# EasyEDA schematic A1_PROM_schematic_64_128.json
TITLE: APPLE-1 MULTI-PROM REPLACEMENT; REV: 1.2; Date: 2020-05-17; Sheet: 1/1; Drawn By: P- Lab; Company: P-LAB
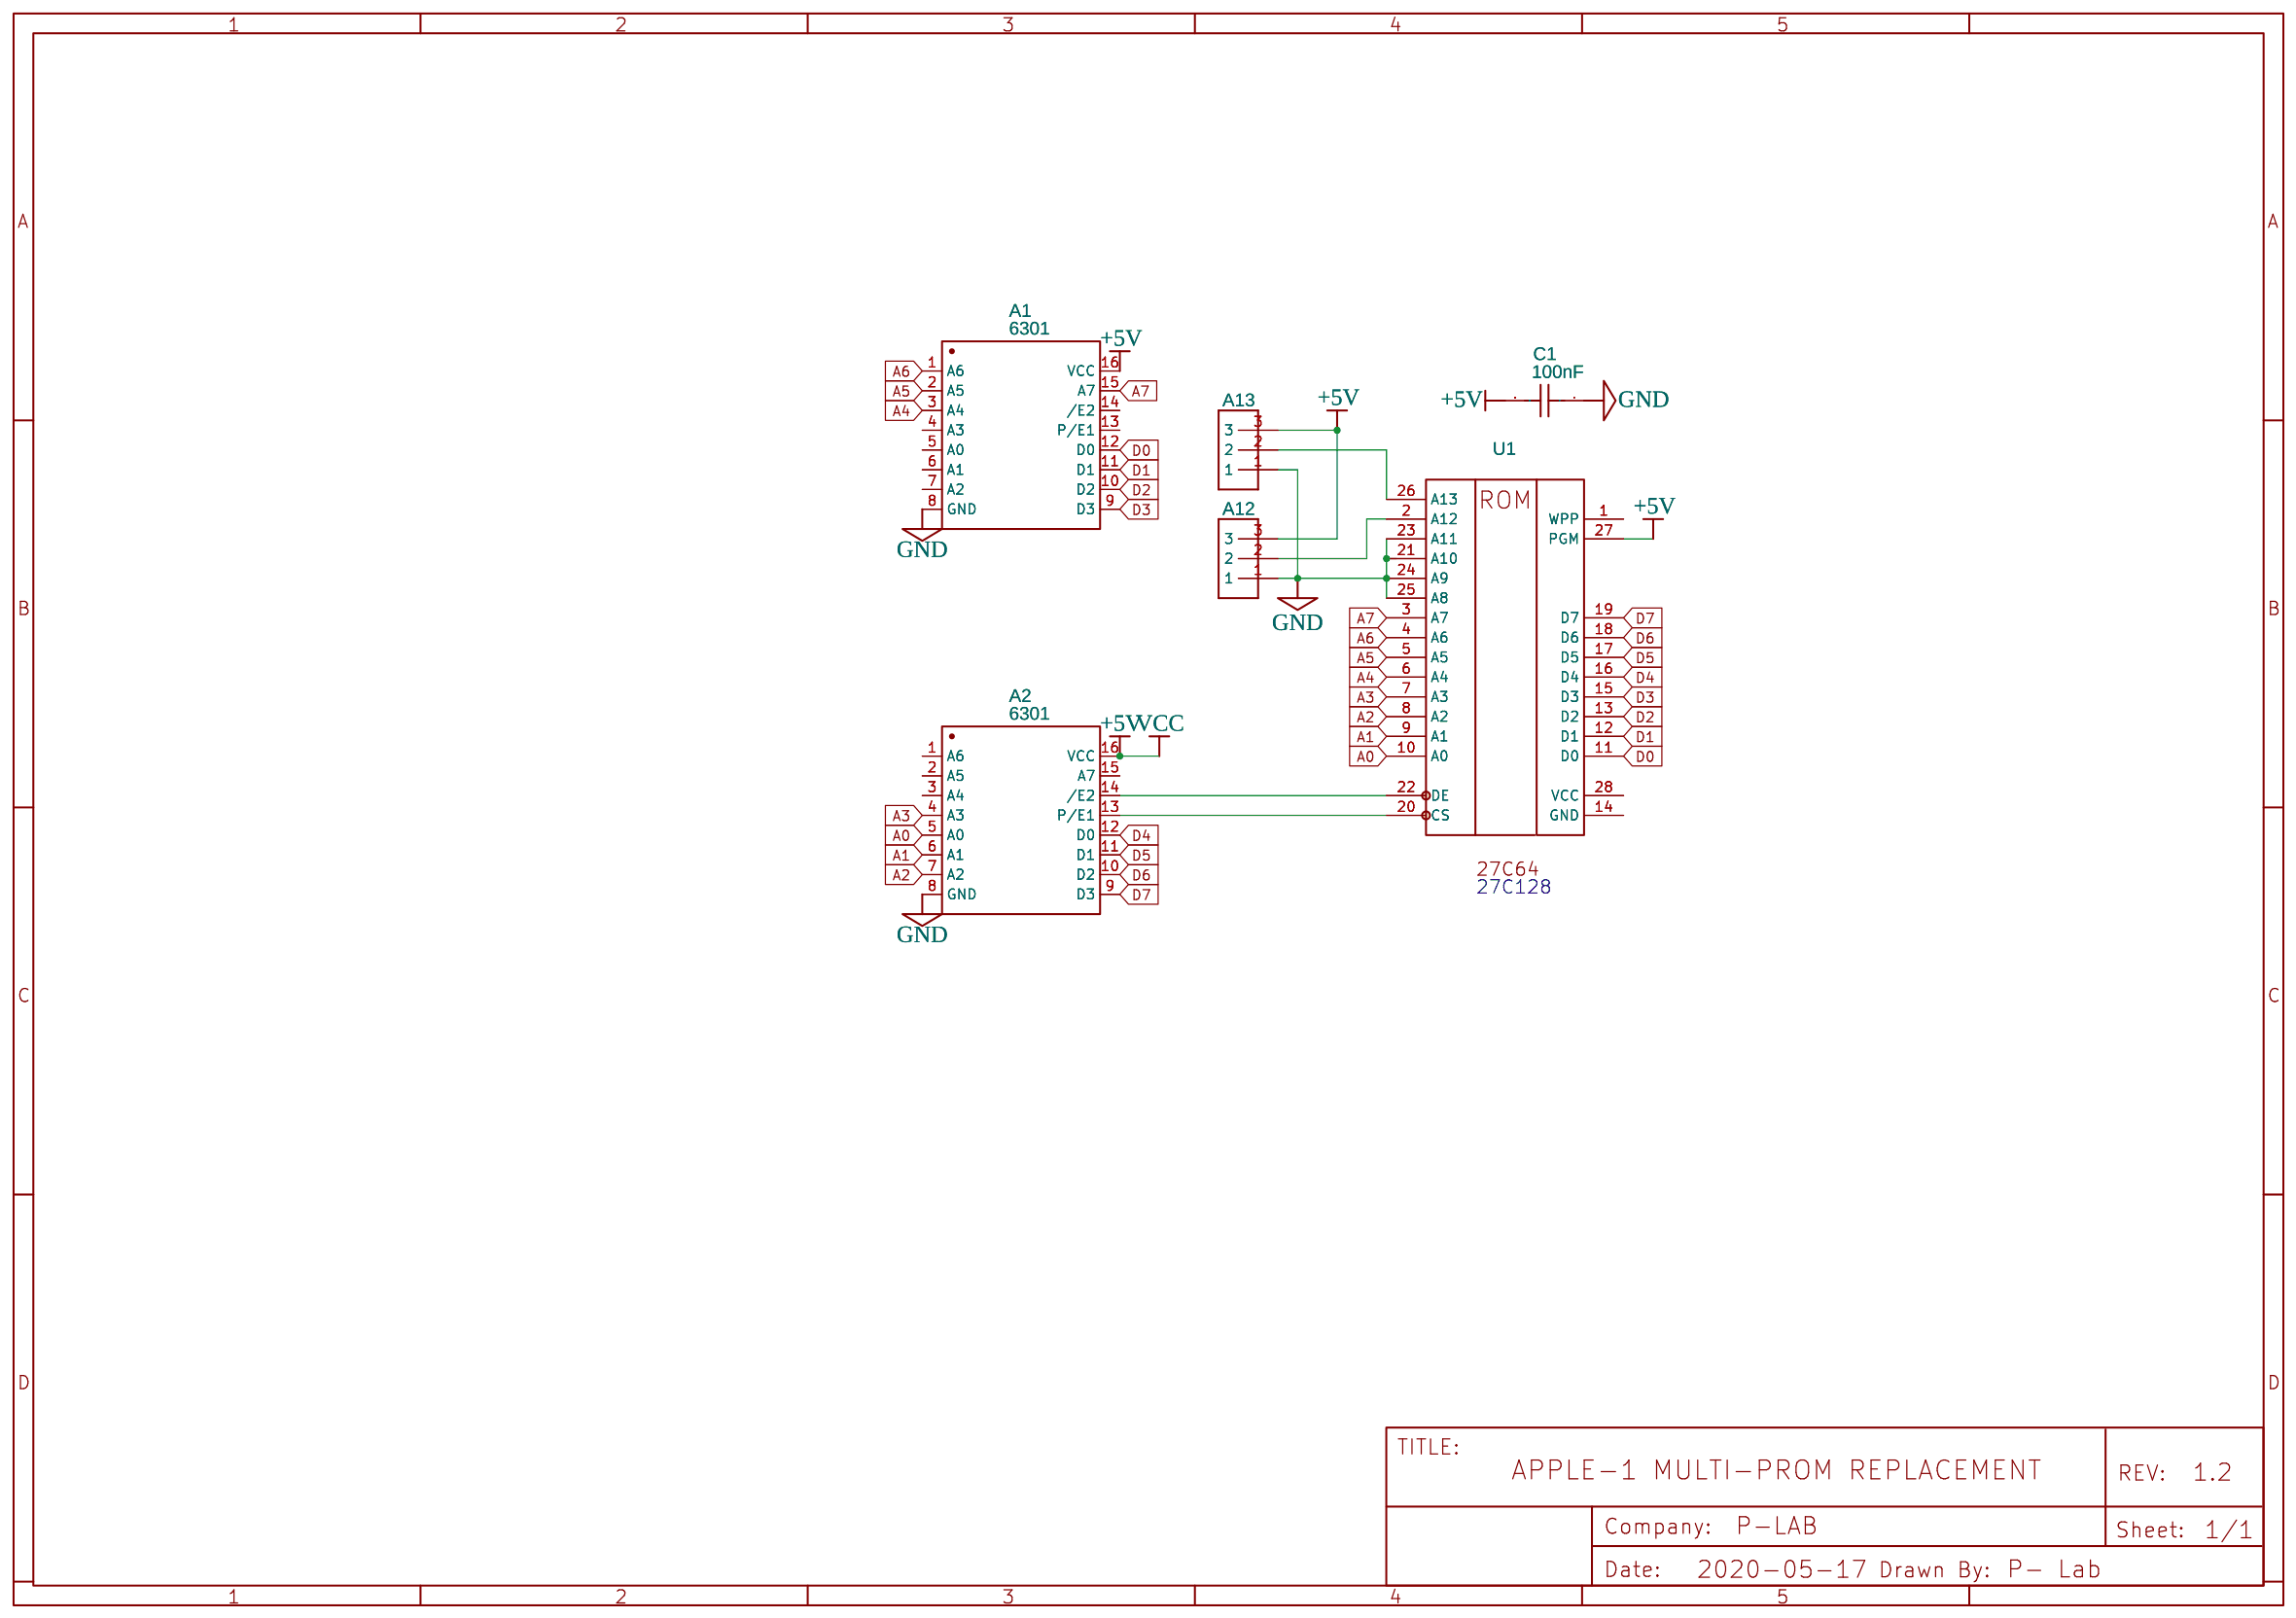
[diagram p0: schematic sheet]

## Parts
A1  6301  [DIP-16_W7.62MM_LONGPADS]
A2  6301  [DIP-16_W7.62MM_LONGPADS]
A12  HEADERDIP3HEADERDIP3  [HEADERDIP3]
A13  HEADERDIP3HEADERDIP3  [HEADERDIP3]
C1  100nF  [CAP-TH_L4.8-W3.2-P5.08-D1.2]
U1  27C64  [DIP-28_L35.6-W17.8-P2.54-LS15.2-BL]

## Library data of the parts
A1 A2 = DIP-16: Supplier: LCSC; Manufacturer: UTC; Manufacturer Part: UT232AG-D16-T; Supplier Part: C98142; Contributor: hotdog6394
A12 A13 = HEADERDIP3HEADERDIP3: null
C1 = CT4G-0805-2X1-50V-0.1UF-K: Supplier: LCSC; Supplier Part: C141981; Manufacturer: TORCH; Manufacturer Part: CT4G-0805-2X1-50V-0.1uF-K; Contributor: LCSC
U1 = 27C128: Supplier: chipdip; Contributor: romychs_4693

## Nets
+5V: A1.16(VCC) A2.16(VCC) A12.3 A13.3 C1.2 U1.27(PGM)
GND: A1.8(GND) A2.8(GND) A12.1 A13.1 C1.1 U1.21(A10) U1.23(A11) U1.24(A9) U1.25(A8)
A0: A2.5(A0) U1.10(A0)
A1: A2.6(A1) U1.9(A1)
A2: A2.7(A2) U1.8(A2)
A3: A2.4(A3) U1.7(A3)
A4: A1.3(A4) U1.6(A4)
A5: A1.2(A5) U1.5(A5)
A6: A1.1(A6) U1.4(A6)
A7: A1.15(A7) U1.3(A7)
D0: A1.12(D0) U1.11(D0)
D1: A1.11(D1) U1.12(D1)
D2: A1.10(D2) U1.13(D2)
D3: A1.9(D3) U1.15(D3)
D4: A2.12(D0) U1.16(D4)
D5: A2.11(D1) U1.17(D5)
D6: A2.10(D2) U1.18(D6)
D7: A2.9(D3) U1.19(D7)
Net-(A2-13): A2.13(P/E1) U1.20(CS)
Net-(A2-14): A2.14(/E2) U1.22(DE)
Net-(A12-2): A12.2 U1.2(A12)
Net-(A13-2): A13.2 U1.26(A13)

Not connected (* = marked no-connect by the designer): A1 4(A3) 5(A0) 6(A1) 7(A2) 13(P/E1) 14(/E2); A2 1(A6) 2(A5) 3(A4) 15(A7); U1 1(WPP) 14(GND) 28(VCC)

## Notes on the sheet
- 27C128
